# Altium schematic sheet ECL_Fanout_X3.SchDoc
size A4; ApprovedBy: Mateusz Kowalik; CheckedBy: Mateusz Kowalik; Author: Mateusz Kowalik; CompanyName: InMotion Labs sp. z o.o.; DrawnBy: Mateusz Kowalik; Engineer: Mateusz Kowalik; Organization: InMotion Labs sp. z o.o.; Address1: Rydlówka 5A; Address2: 30-363 Kraków; Address4: Poland; DocumentNumber: 12; Revision: Rev 0; SheetNumber: 12; SheetTotal: 17
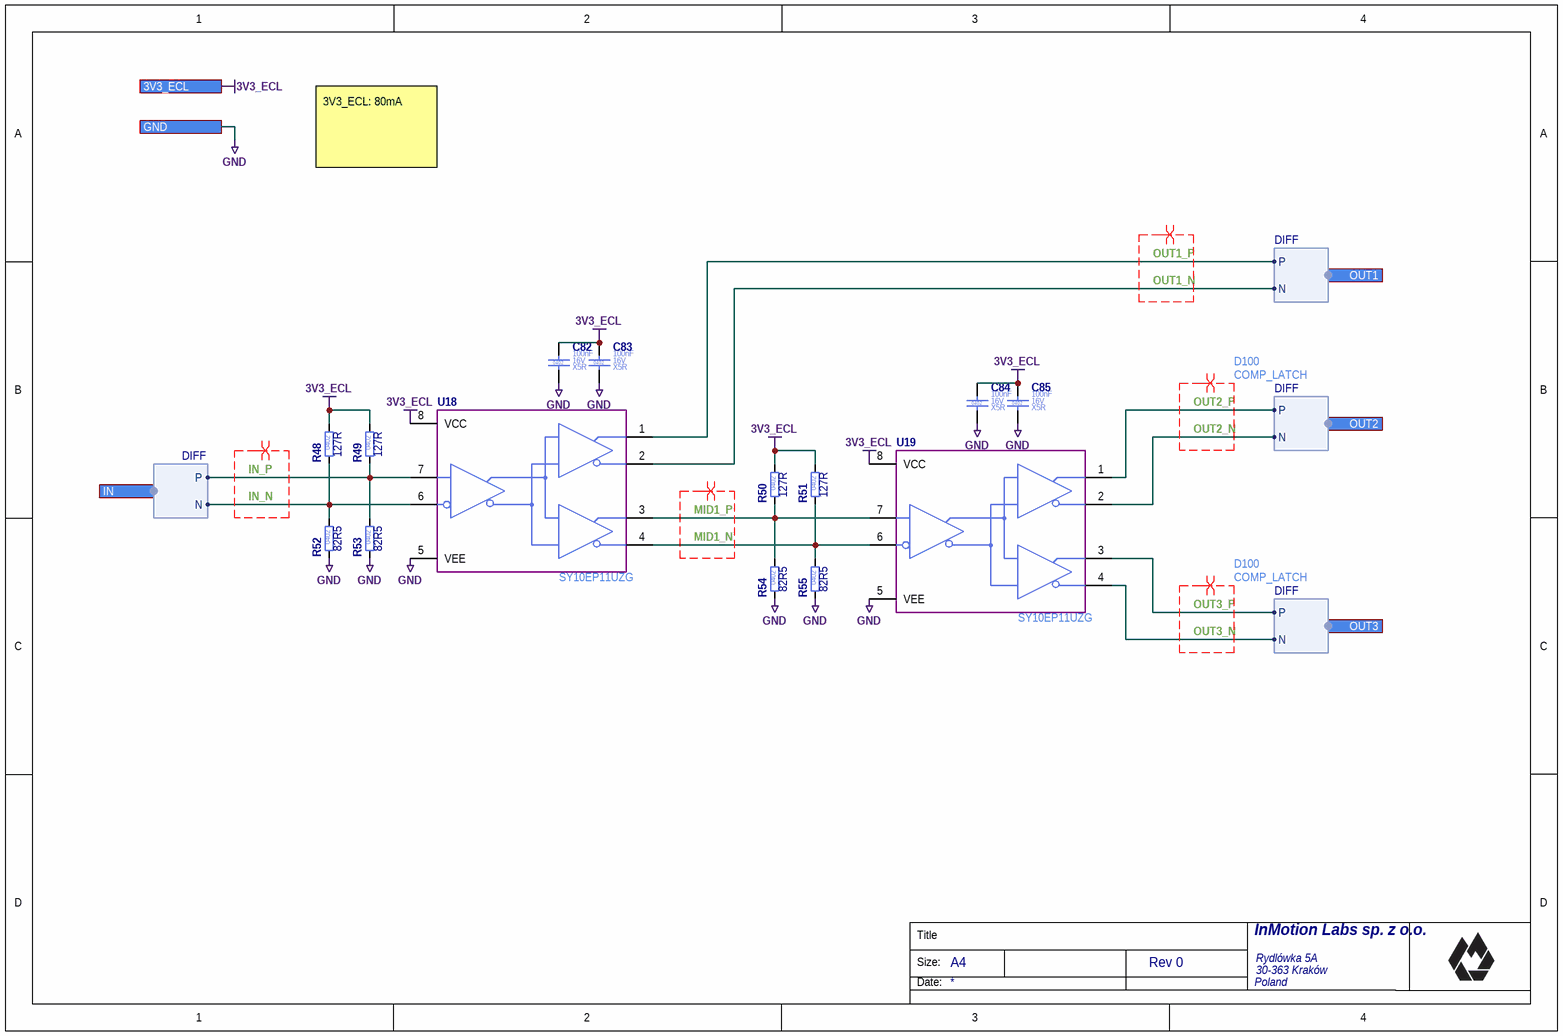
[diagram p0: ECL_Fanout_X3.SchDoc]

## Parts
C82  Case/Package: 0402  Voltage Rating (DC): 16V  Dielectric: X5R  Capacitance: 100nF  [C_0402_1005]  (hidden comment: C_100NF_16V_X5R_0402_10)
C83  Case/Package: 0402  Voltage Rating (DC): 16V  Dielectric: X5R  Capacitance: 100nF  [C_0402_1005]  (hidden comment: C_100NF_16V_X5R_0402_10)
C84  Case/Package: 0402  Voltage Rating (DC): 16V  Dielectric: X5R  Capacitance: 100nF  [C_0402_1005]  (hidden comment: C_100NF_16V_X5R_0402_10)
C85  Case/Package: 0402  Voltage Rating (DC): 16V  Dielectric: X5R  Capacitance: 100nF  [C_0402_1005]  (hidden comment: C_100NF_16V_X5R_0402_10)
R48  Resistance: 127R  Case/Package: 0402  [R_0402_1005]  (hidden comment: R_127R_0402_1)
R49  Resistance: 127R  Case/Package: 0402  [R_0402_1005]  (hidden comment: R_127R_0402_1)
R50  Resistance: 127R  Case/Package: 0402  [R_0402_1005]  (hidden comment: R_127R_0402_1)
R51  Resistance: 127R  Case/Package: 0402  [R_0402_1005]  (hidden comment: R_127R_0402_1)
R52  Resistance: 82R5  Case/Package: 0402  [R_0402_1005]  (hidden comment: R_82R5_0402_1)
R53  Resistance: 82R5  Case/Package: 0402  [R_0402_1005]  (hidden comment: R_82R5_0402_1)
R54  Resistance: 82R5  Case/Package: 0402  [R_0402_1005]  (hidden comment: R_82R5_0402_1)
R55  Resistance: 82R5  Case/Package: 0402  [R_0402_1005]  (hidden comment: R_82R5_0402_1)
U18  SY10EP11UZG  [SOIC127P600X170-8N]
U19  SY10EP11UZG  [SOIC127P600X170-8N]

## Ports
3V3_ECL, GND, IN (harness DIFF), OUT1 (harness DIFF), OUT2 (harness DIFF), OUT3 (harness DIFF)

## Harnesses
DIFF: P, N

## Nets
3V3_ECL: C82.1 C83.1 C84.1 C85.1 R48.2 R49.2 R50.2 R51.2 U18.8(VCC) U19.8(VCC) ; port 3V3_ECL
GND: C82.2 C83.2 C84.2 C85.2 R52.1 R53.1 R54.1 R55.1 U18.5(VEE) U19.5(VEE) ; port GND
IN_N: R48.1 R52.2 U18.6(~{D}) ; port IN.N
IN_P: R49.1 R53.2 U18.7(D) ; port IN.P
MID1_N: R51.1 R55.2 U18.4(~{Q1}) U19.6(~{D})
MID1_P: R50.1 R54.2 U18.3(Q1) U19.7(D)
OUT1_N: U18.2(/Q0) ; port OUT1.N
OUT1_P: U18.1(Q0) ; port OUT1.P
OUT2_N: U19.2(/Q0) ; port OUT2.N
OUT2_P: U19.1(Q0) ; port OUT2.P
OUT3_N: U19.4(~{Q1}) ; port OUT3.N
OUT3_P: U19.3(Q1) ; port OUT3.P

## Layout directives
differential pair; differential pair class D100; net class D100: IN_N, IN_P, MID1_N, MID1_P, OUT1_N, OUT1_P
differential pair; differential pair class D100; net class D100; differential pair class COMP_LATCH: OUT2_N, OUT2_P, OUT3_N, OUT3_P

## Notes on the sheet
- 3V3_ECL: 80mA
- Title
- Size:
- Date:
- A4

## Library data of the parts
C82-C85 = C_100NF_16V_X5R_0402_10: Ceramic Capacitor; Manufacturer Part Number: EMK105BJ104KV-F; Manufacturer: Taiyo Yuden; Value: 100nF; Tolerance: 10%; Part Number: C_100NF_16V_X5R_0402_10; Mount: Surface Mount; Height: 500um; HelpURL: http://datasheet.octopart.com/EMK105BJ104KV-F-Taiyo-Yuden-datasheet-8857305.pdf; RoHS: Compliant; Max Operating Temperature: 125°C; Status: MK; Supplier 1: Mouser; Supplier Part Number 1: 963-EMK105BJ104KV-F; Manufacturer 2: Samsung Electro-Mechanics; Manufacturer Part Number 2: CL05B104KO5NNNC; Supplier 2: LCSC; Supplier Part Number 2: C1525
R48-R51 = R_127R_0402_1: Thick Film Resistor; Manufacturer: Yageo; Manufacturer Part Number: RC0402FR-07127RL; Value: 127R; Tolerance: 1%; Voltage Rating (DC): 50V; Power Rating: 63mW; Stats: MK; Part Number: R_127R_0402_1; Mount: Surface Mount; Height: 350um; HelpURL: https://pl.mouser.com/datasheet/2/447/PYu_RC_Group_51_RoHS_L_10-1664068.pdf; RoHS: Compliant; Max Operating Temperature: 155°C; Supplier 1: Mouser; Supplier Part Number 1: 603-RC0402FR-07127RL; Manufacturer 2: Uniroyal Elec; Manufacturer Part Number 2: 0402WGF1270TCE; Supplier 2: LCSC; Supplier Part Number 2: C247127
R52-R55 = R_82R5_0402_1: Thick Film Resistor; Manufacturer: Yageo; Manufacturer Part Number: RC0402FR-0782R5L; Value: 82R5; Tolerance: 1%; Voltage Rating (DC): 50V; Power Rating: 63mW; Stats: MK; Part Number: R_82R5_0402_1; Mount: Surface Mount; Height: 350um; HelpURL: https://pl.mouser.com/datasheet/2/447/PYu-RC_Group_51_RoHS_L_10-1527934.pdf; RoHS: Compliant; Max Operating Temperature: 155°C; Supplier 1: Mouser; Supplier Part Number 1: 603-RC0402FR-0782R5L; Manufacturer 2: Uniroyal Elec; Manufacturer Part Number 2: 0402WGF825JTCE; Supplier 2: LCSC; Supplier Part Number 2: C52037
U18 U19 = SY10EP11UZG: 1:2 PECL Fanout Buffer; Manufacturer: Microchip; Max Output Current: 100mA; Marking: Z8-1; Max Supply Voltage: 3.6V; Min Supply Voltage: 3.0V; Part Number: SY10EP11UZG; Case/Package: SOIC8; Mount: Surface Mount; Height: 1.75mm; HelpURL: https://datasheet.octopart.com/SY10EP11UZG-Microchip-datasheet-39498.pdf; Max Operating Temperature: 85°C; RoHS: Compliant; Status: MK; Manufacturer Part Number: SY10EP11UZG; Supplier 1: Mouser; Supplier Part Number 1: 998-SY10EP11UZG